# Altium schematic sheet CONTROL.SchDoc: CONTROL
size A4; SheetNumber: 4; SheetTotal: 5
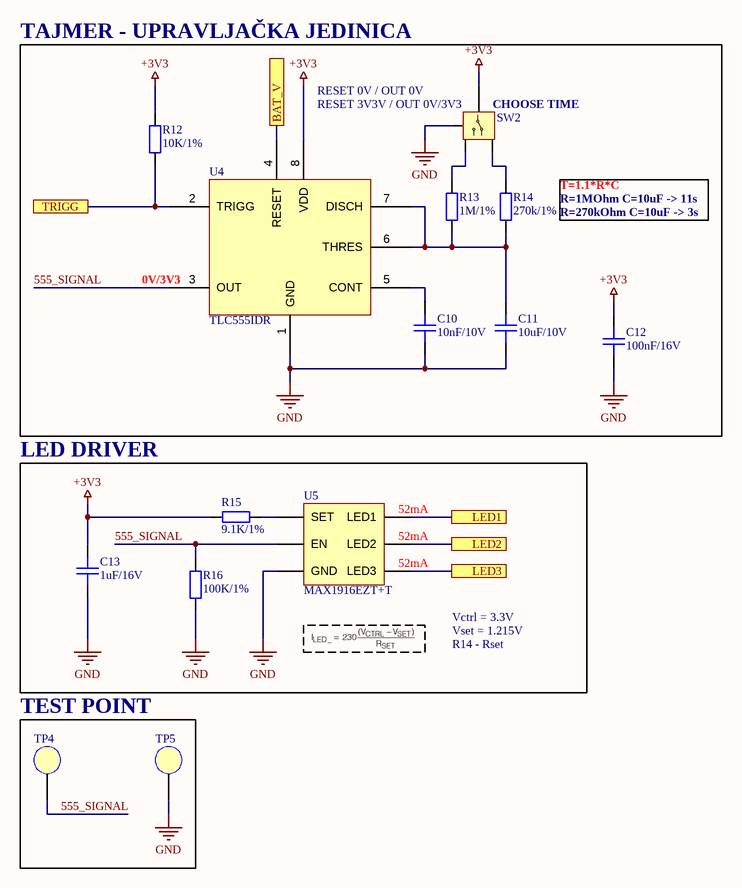
[diagram p0: CONTROL.SchDoc]

## Parts
C10  10nF/10V  [CAP_0603]
C11  10uF/10V  [CAP_0603]
C12  100nF/16V  [CAP_0603]
C13  1uF/16V  [CAP_0603]
R12  10K/1%  [RES_0603]
R13  1M/1%  [RES_0603]
R14  270k/1%  [RES_0603]
R15  9.1K/1%  [RES_0603]
R16  100K/1%  [RES_0603]
SW2  SWITCH_MAIN  [SWITCH_SK-12F17-G_HORIZONTAL]  (value not drawn)
TP4  TESTPOINT  [TESTPOINT]  (value not drawn)
TP5  TESTPOINT  [TESTPOINT]  (value not drawn)
U4  TLC555IDR  [8-SOIC]
U5  MAX1916EZT+T  [SOT23-6]

## Blocks framed on the sheet
TAJMER - UPRAVLJAČKA JEDINICA: C10-C12 R12-R14 SW2 U4
LED DRIVER: C13 R15 R16 U5
TEST POINT: TP4 TP5

## Ports
BAT_V, LED1, LED2, LED3, TRIGG

## Nets
+3V3: C12.2 C13.2 R12.2 R15.1 SW2.1(1P) U4.8(VDD)
GND: C10.1 C11.1 C12.1 C13.1 R16.1 SW2.4(GND) TP5.1(TP) U4.1(GND) U5.2(GND)
555_SIGNAL: R16.2 TP4.1(TP) U4.3(OUT) U5.1(EN)
BAT_V: U4.4(RESET) ; port BAT_V
LED1: U5.6(LED1) ; port LED1
LED2: U5.5(LED2) ; port LED2
LED3: U5.4(LED3) ; port LED3
TRIGG: R12.1 U4.2(TRIGG) ; port TRIGG
NetC10_2: C10.2 U4.5(CONT)
NetC11_2: C11.2 R13.1 R14.1 U4.6(THRES) U4.7(DISCH)
NetR13_2: R13.2 SW2.2(2T)
NetR14_2: R14.2 SW2.3(3T)
NetR15_2: R15.2 U5.3(SET)

## Notes on the sheet
- (near SW2) RESET 0V / OUT 0V
- (near SW2) RESET 3V3V / OUT 0V/3V3
- (near SW2) CHOOSE TIME
- T=1.1*R*C
- R=1MOhm C=10uF -> 11s
- R=270kOhm C=10uF -> 3s
- (near U4) 0V/3V3
- (near U5) 52mA
- Vctrl = 3.3V
- Vset = 1.215V
- R14 - Rset
- Title
- Project
- Size
- Designed By
- Date
- Revision
- A4
- Checked By

## Library data of the parts
C10 = 10nF/10V: 10000 pF ±10% 50V Ceramic Capacitor X7R 0603 (1608 Metric); MPN: 0603B103K500CT
C11 = 10uF/10V: 10 µF ±10% 10V Ceramic Capacitor X5R 0603 (1608 Metric); MPN: CL10A106KP8NNNC
C12 = 100nF/16V: 0.1 µF ±10% 16V Ceramic Capacitor X7R 0603 (1608 Metric); MPN: CC0603KRX7R7BB104
C13 = 1uF/16V: 1 µF ±5% 16V Ceramic Capacitor X7R 0603 (1608 Metric); MPN: 0603YC105JAT2A
R12 = 10K/1%: 10 kOhms ±1% 0.1W, 1/10W Chip Resistor 0603 (1608 Metric) Moisture Resistant Thick Film; MPN: CR0603-FX-1002ELF
R13 = 1M/1%: 1 MOhms ±1% 0.1W, 1/10W Chip Resistor 0603 (1608 Metric) Automotive AEC-Q200 Thick Film; MPN: RMCF0603FT1M00
R14 = 270k/1%: 270 kOhms ±1% 0.1W, 1/10W Chip Resistor 0603 (1608 Metric) Automotive AEC-Q200 Thick Film; MPN: ERJ-3EKF2703V
R15 = 9.1K/1%: 9.1 kOhms ±1% 0.1W, 1/10W Chip Resistor 0603 (1608 Metric) Thick Film; MPN: CRCW06039K10FKEAC
R16 = 100K/1%: 100 kOhms ±1% 0.1W, 1/10W Chip Resistor 0603 (1608 Metric) Automotive AEC-Q200 Thick Film; MPN: ERJ-3EKF1003V
SW2 = SWITCH_MAIN: SWITCH SLIDE SPDT 300MA 30V; MPN: SK-12F17-G 7
TP4 TP5 = TESTPOINT: White PC Test Point, Miniature Phosphor Bronze Silver Plating Through Hole Mounting Type; MPN: 5002
U4 = TLC555IDR: 555 Type, Timer/Oscillator (Single) IC 2.1MHz 8-SOIC; MPN: TLC555IDR
U5 = LED DRIVER MAX1916: LED Driver IC 3 Output Linear Dimming 60mA TSOT-23-6; MPN: MAX1916EZT+T